# EasyEDA schematic SCH.json
TITLE: 颈椎保护系统; REV: 1.0; Sheet: 1/1; Company: Your Company
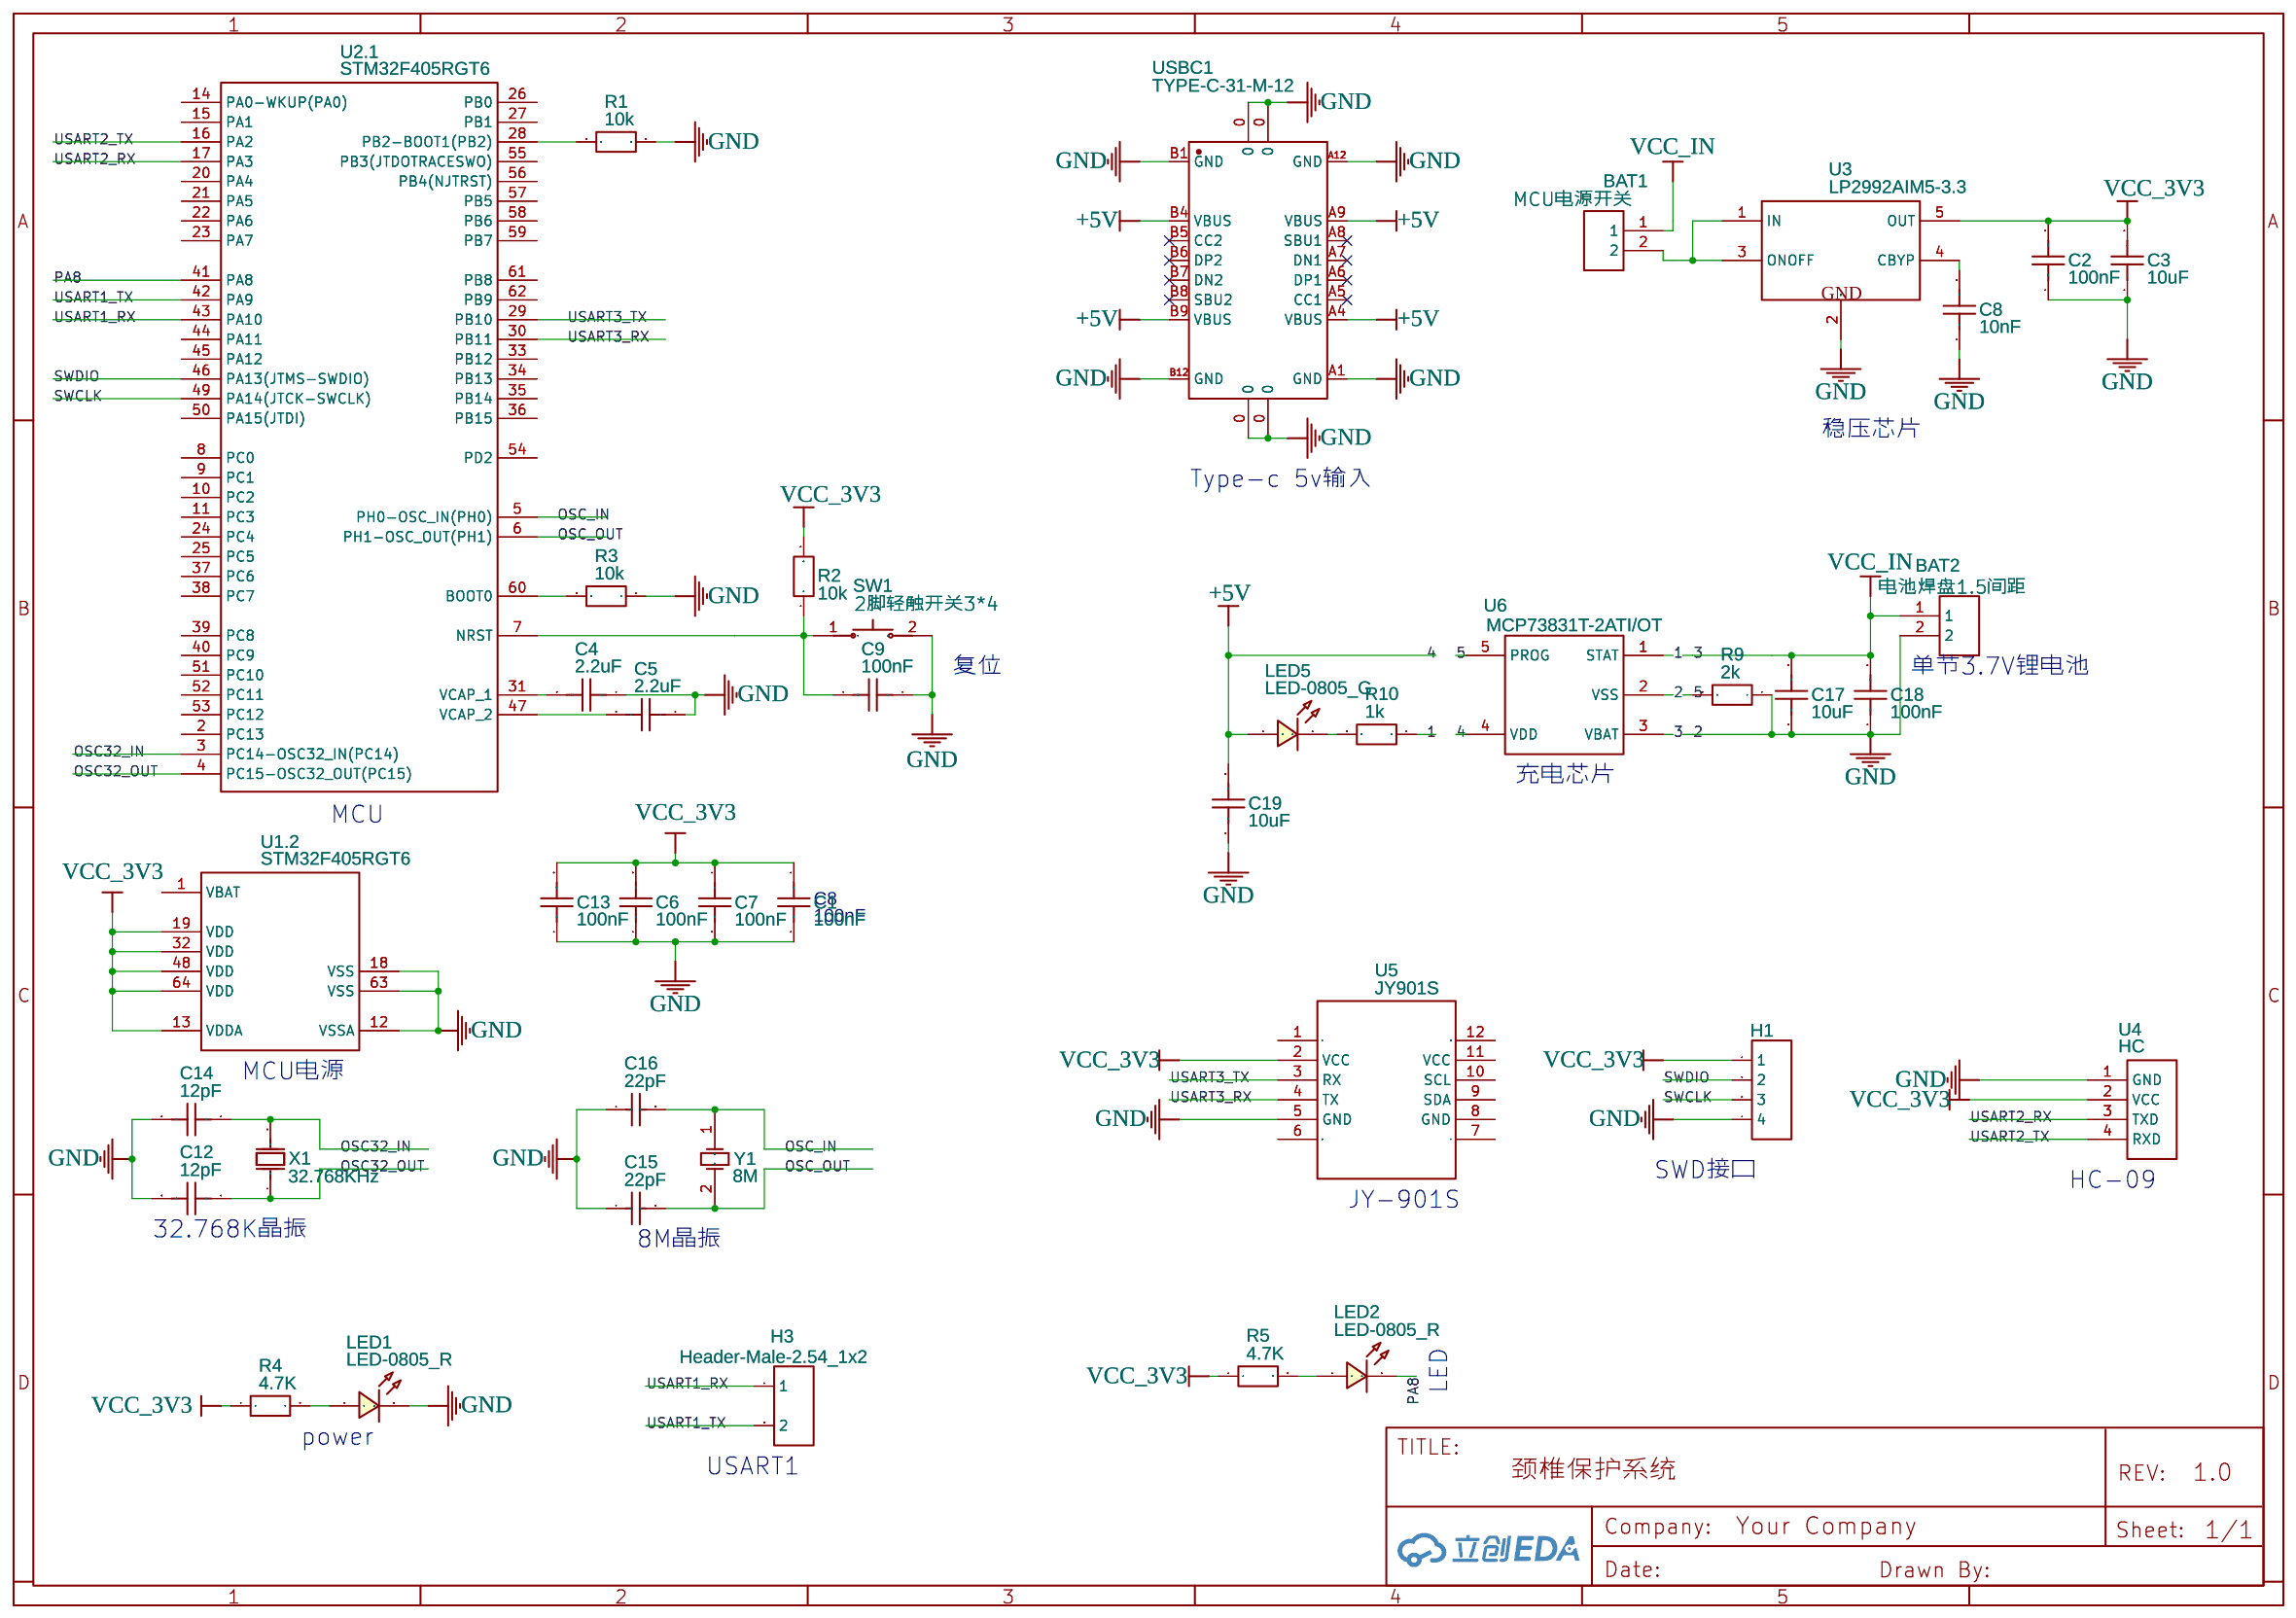
[diagram p0: schematic sheet]

## Parts
BAT1  MCU电源开关  [电池焊盘]
BAT2  电池焊盘1.5间距  [电池焊盘]
C1  100nF  [C0402]
C2  100nF  [C0402]
C3  10uF  [C0402]
C4  2.2uF  [C0402]
C5  2.2uF  [C0402]
C6  100nF  [C0402]
C7  100nF  [C0402]
C8  10nF  [C0402]
C9  100nF  [C0402]
C12  12pF  [C0402]
C13  100nF  [C0402]
C14  12pF  [C0402]
C15  22pF  [C0402]
C16  22pF  [C0402]
C17  10uF  [C0402]
C18  100nF  [C0402]
C19  10uF  [C0402]
H1  HDR-F-2.54_1x4  [HDR-F-2.54_1X4]
H3  Header-Male-2.54_1x2  [HDR-TH_2P-P2.54-V-M-1]
LED1  LED-0805_R  [LED0805_RED]
LED2  LED-0805_R  [LED0805_RED]
LED5  LED-0805_G  [LED0805_GREEN]
R1  10k  [R0402]
R2  10k  [R0402]
R3  10k  [R0402]
R4  4.7K  [R0402]
R5  4.7K  [R0402]
R9  2k  [R0402]
R10  1k  [R0402]
SW1  2脚轻触开关3*4  [SW-SMD_2P-L4-W3-LS5]
U1  STM32F405RGT6  [LQFP-64_L10.0-W10.0-P0.50-LS12.0-BL]  (section 2)
U2  STM32F405RGT6  [LQFP-64_L10.0-W10.0-P0.50-LS12.0-BL]  (section 1)
U3  LP2992AIM5-3.3  [SOT23-5]
U4  HC  [HC-09]
U5  JY901S  [JY901_SMD_15_15_2.54]
U6  MCP73831T-2ATI/OT  [SOT-23-5_L3.0-W1.7-P0.95-LS2.8-BR]
USBC1  TYPE-C-31-M-12  [USB-TYPE-C_16PIN-MALE-TYPE-C-31-M-12]
X1  32.768KHz  [TXAL-2*6-H]
Y1  8M  [SMD-5032_2P]

## Library data of the parts
BAT1 BAT2 = 电池焊盘1.5间距: Contributor: DoM
C1-C9 C13 C17-C19 = C_0402_US: Contributor: LCEDA_Lib
C12 C14 = CL10C100JB81PNC: Supplier: LCSC; Supplier Part: C307356; Manufacturer: Samsung Electro-Mechanics; Contributor: LCSC
C15 C16 = CL10C220JB8NNNC: Supplier: LCSC; Manufacturer: SAMSUNG; LCSC Assembly: Yes; Supplier Part: C1653; SMT Type: Basic
H1 = HDR-F-2.54_1x4: Supplier Part: C225501; Supplier: LCSC; Contributor: LCEDA_Lib
H3 = Header-Male-2.54_1x2: Supplier: LCSC; Manufacturer: TE Connectivity; Manufacturer Part: 826629-2; Supplier Part: C86471; JLCPCB Part Class: Extended Part
LED1 LED2 = LED-0805_R: Manufacturer: EVERLIGHT(台湾亿光); Manufacturer Part: 17-21SURC/S530-A3/TR8; Supplier Part: C72037; Contributor: LCEDA_Lib
LED5 = LED-0805_G: Manufacturer: 国星光电; Manufacturer Part: NCD0805G1; Supplier Part: C84260; Contributor: LCEDA_Lib
R1-R5 R9 R10 = R_0402_EU: Contributor: LCEDA_Lib
SW1 = 2脚轻触开关3*4: Contributor: zhangqibao
U1 U2 = STM32F405RGT6: tags: STM32; Supplier Part: C15742; Supplier: LCSC; Manufacturer: ST; subpart_no: 1; image: http://image.lceda.cn/szlcsc/C15742.jpg; JLCPCB Part Class: Extended Part
U3 = LP2992AIM5-3.3: Micropower 250 mA Low-Noise Ultra Low-Dropout Regulator, 5-pin SOT-23; Contributor: axaxax
U4 = HC: Contributor: hhhhhhhhhhhhh
U5 = JY901S: Supplier: witmotion; Contributor: fit20190701
U6 = MCP73831T-2ATI/OT: Supplier: LCSC; Manufacturer: MICROCHIP; Supplier Part: C14879; JLCPCB Part Class: Extended Part
USBC1 = TYPE-C-31-M-12: Supplier: LCSC; Supplier Part: C165948; Manufacturer: Rectangular Connectors - Contacts; Contributor: william009
X1 = EXS00A-MU00202: Supplier: LCSC; Supplier Part: C280830; Manufacturer: Nihon Dempa Kogyo; Contributor: LCSC
Y1 = XTAL: Contributor: xf8460

## Nets
+5V: C19.2 LED5.1 U6.4(VDD) USBC1.A4(VBUS) USBC1.A9(VBUS) USBC1.B4(VBUS) USBC1.B9(VBUS)
VCC_3V3: C1.1 C2.2 C3.2 C6.2 C7.1 C13.2 H1.1 R2.2 R4.1 R5.1 U1.13(VDDA) U1.19(VDD) U1.32(VDD) U1.48(VDD) U1.64(VDD) U3.5(OUT) U4.2(VCC) U5.2(VCC)
1: R10.1 U6.1(STAT)
2: BAT2.2 C1.2 C2.1 C3.1 C4.1 C5.1 C6.1 C7.2 C8.1 C9.1 C12.2 C13.1 C14.2 C15.1 C16.1 C17.1 C18.1 C19.1 H1.4 LED1.2 R1.2 R3.1 R9.1 SW1.2 U1.12(VSSA) U1.18(VSS) U1.63(VSS) U3.2(GND) U4.1(GND) U5.5(GND) U6.2(VSS) USBC1.0 USBC1.A1(GND) USBC1.A12(GND) USBC1.B1(GND) USBC1.B12(GND)
3: BAT1.1 BAT2.1 C17.2 C18.2 U6.3(VBAT)
5: R9.2 U6.5(PROG)
OSC32_IN: C14.1 U2.3(PC14-OSC32_IN(PC14)) X1.2(OSC2)
OSC32_OUT: C12.1 U2.4(PC15-OSC32_OUT(PC15)) X1.1(OSC1)
OSC_IN: C16.2 U2.5(PH0-OSC_IN(PH0)) Y1.1(OSC1)
OSC_OUT: C15.2 U2.6(PH1-OSC_OUT(PH1)) Y1.2(OSC2)
PA8: LED2.2 U2.41(PA8)
SWCLK: H1.3 U2.49(PA14(JTCK-SWCLK))
SWDIO: H1.2 U2.46(PA13(JTMS-SWDIO))
USART1_RX: H3.1 U2.43(PA10)
USART1_TX: H3.2 U2.42(PA9)
USART2_RX: U2.17(PA3) U4.3(TXD)
USART2_TX: U2.16(PA2) U4.4(RXD)
USART3_RX: U2.30(PB11) U5.4(TX)
USART3_TX: U2.29(PB10) U5.3(RX)
Net-(BAT1-2): BAT1.2 U3.1(IN) U3.3(ONOFF)
Net-(C4-2): C4.2 U2.31(VCAP_1)
Net-(C5-2): C5.2 U2.47(VCAP_2)
Net-(C8-2): C8.2 U3.4(CBYP)
Net-(C9-2): C9.2 R2.1 SW1.1 U2.7(NRST)
Net-(LED1-1): LED1.1 R4.2
Net-(LED2-1): LED2.1 R5.2
Net-(LED5-2): LED5.2 R10.2
Net-(R1-1): R1.1 U2.28(PB2-BOOT1(PB2))
Net-(R3-2): R3.2 U2.60(BOOT0)

Not connected (* = marked no-connect by the designer): U1 1(VBAT); U2 2(PC13) 8(PC0) 9(PC1) 10(PC2) 11(PC3) 14(PA0-WKUP(PA0)) 15(PA1) 20(PA4) 21(PA5) 22(PA6) 23(PA7) 24(PC4) 25(PC5) 26(PB0) 27(PB1) 33(PB12) 34(PB13) 35(PB14) 36(PB15) 37(PC6) 38(PC7) 39(PC8) 40(PC9) 44(PA11) 45(PA12) 50(PA15(JTDI)) 51(PC10) 52(PC11) 53(PC12) 54(PD2) 55(PB3(JTDOTRACESWO)) 56(PB4(NJTRST)) 57(PB5) 58(PB6) 59(PB7) 61(PB8) 62(PB9); U5 1 6 7 8(GND) 9(SDA) 10(SCL) 11(VCC) 12; USBC1 A5(CC1)* A6(DP1)* A7(DN1)* A8(SBU1)* B5(CC2)* B6(DP2)* B7(DN2)* B8(SBU2)*

## Notes on the sheet
- 稳压芯片
- Type-c 5v输入
- 复位
- 单节3.7V锂电池
- 充电芯片
- MCU
- C8
- 100nF
- MCU电源
- SWD接口
- JY-901S
- HC-09
- 32.768K晶振
- 8M晶振
- LED
- power
- USART1
